# EasyEDA Pro project busmaster-v102.eprj, schematic main-board
Board Name: main-board; Create Date: 2025-11-11; Page Name: P1; Project Name: busmaster-v102; Schematic Name: main-board; Update Date: 2026-09-04; Company: EasyEDA.com; Page Size: A4; Version: V1.0
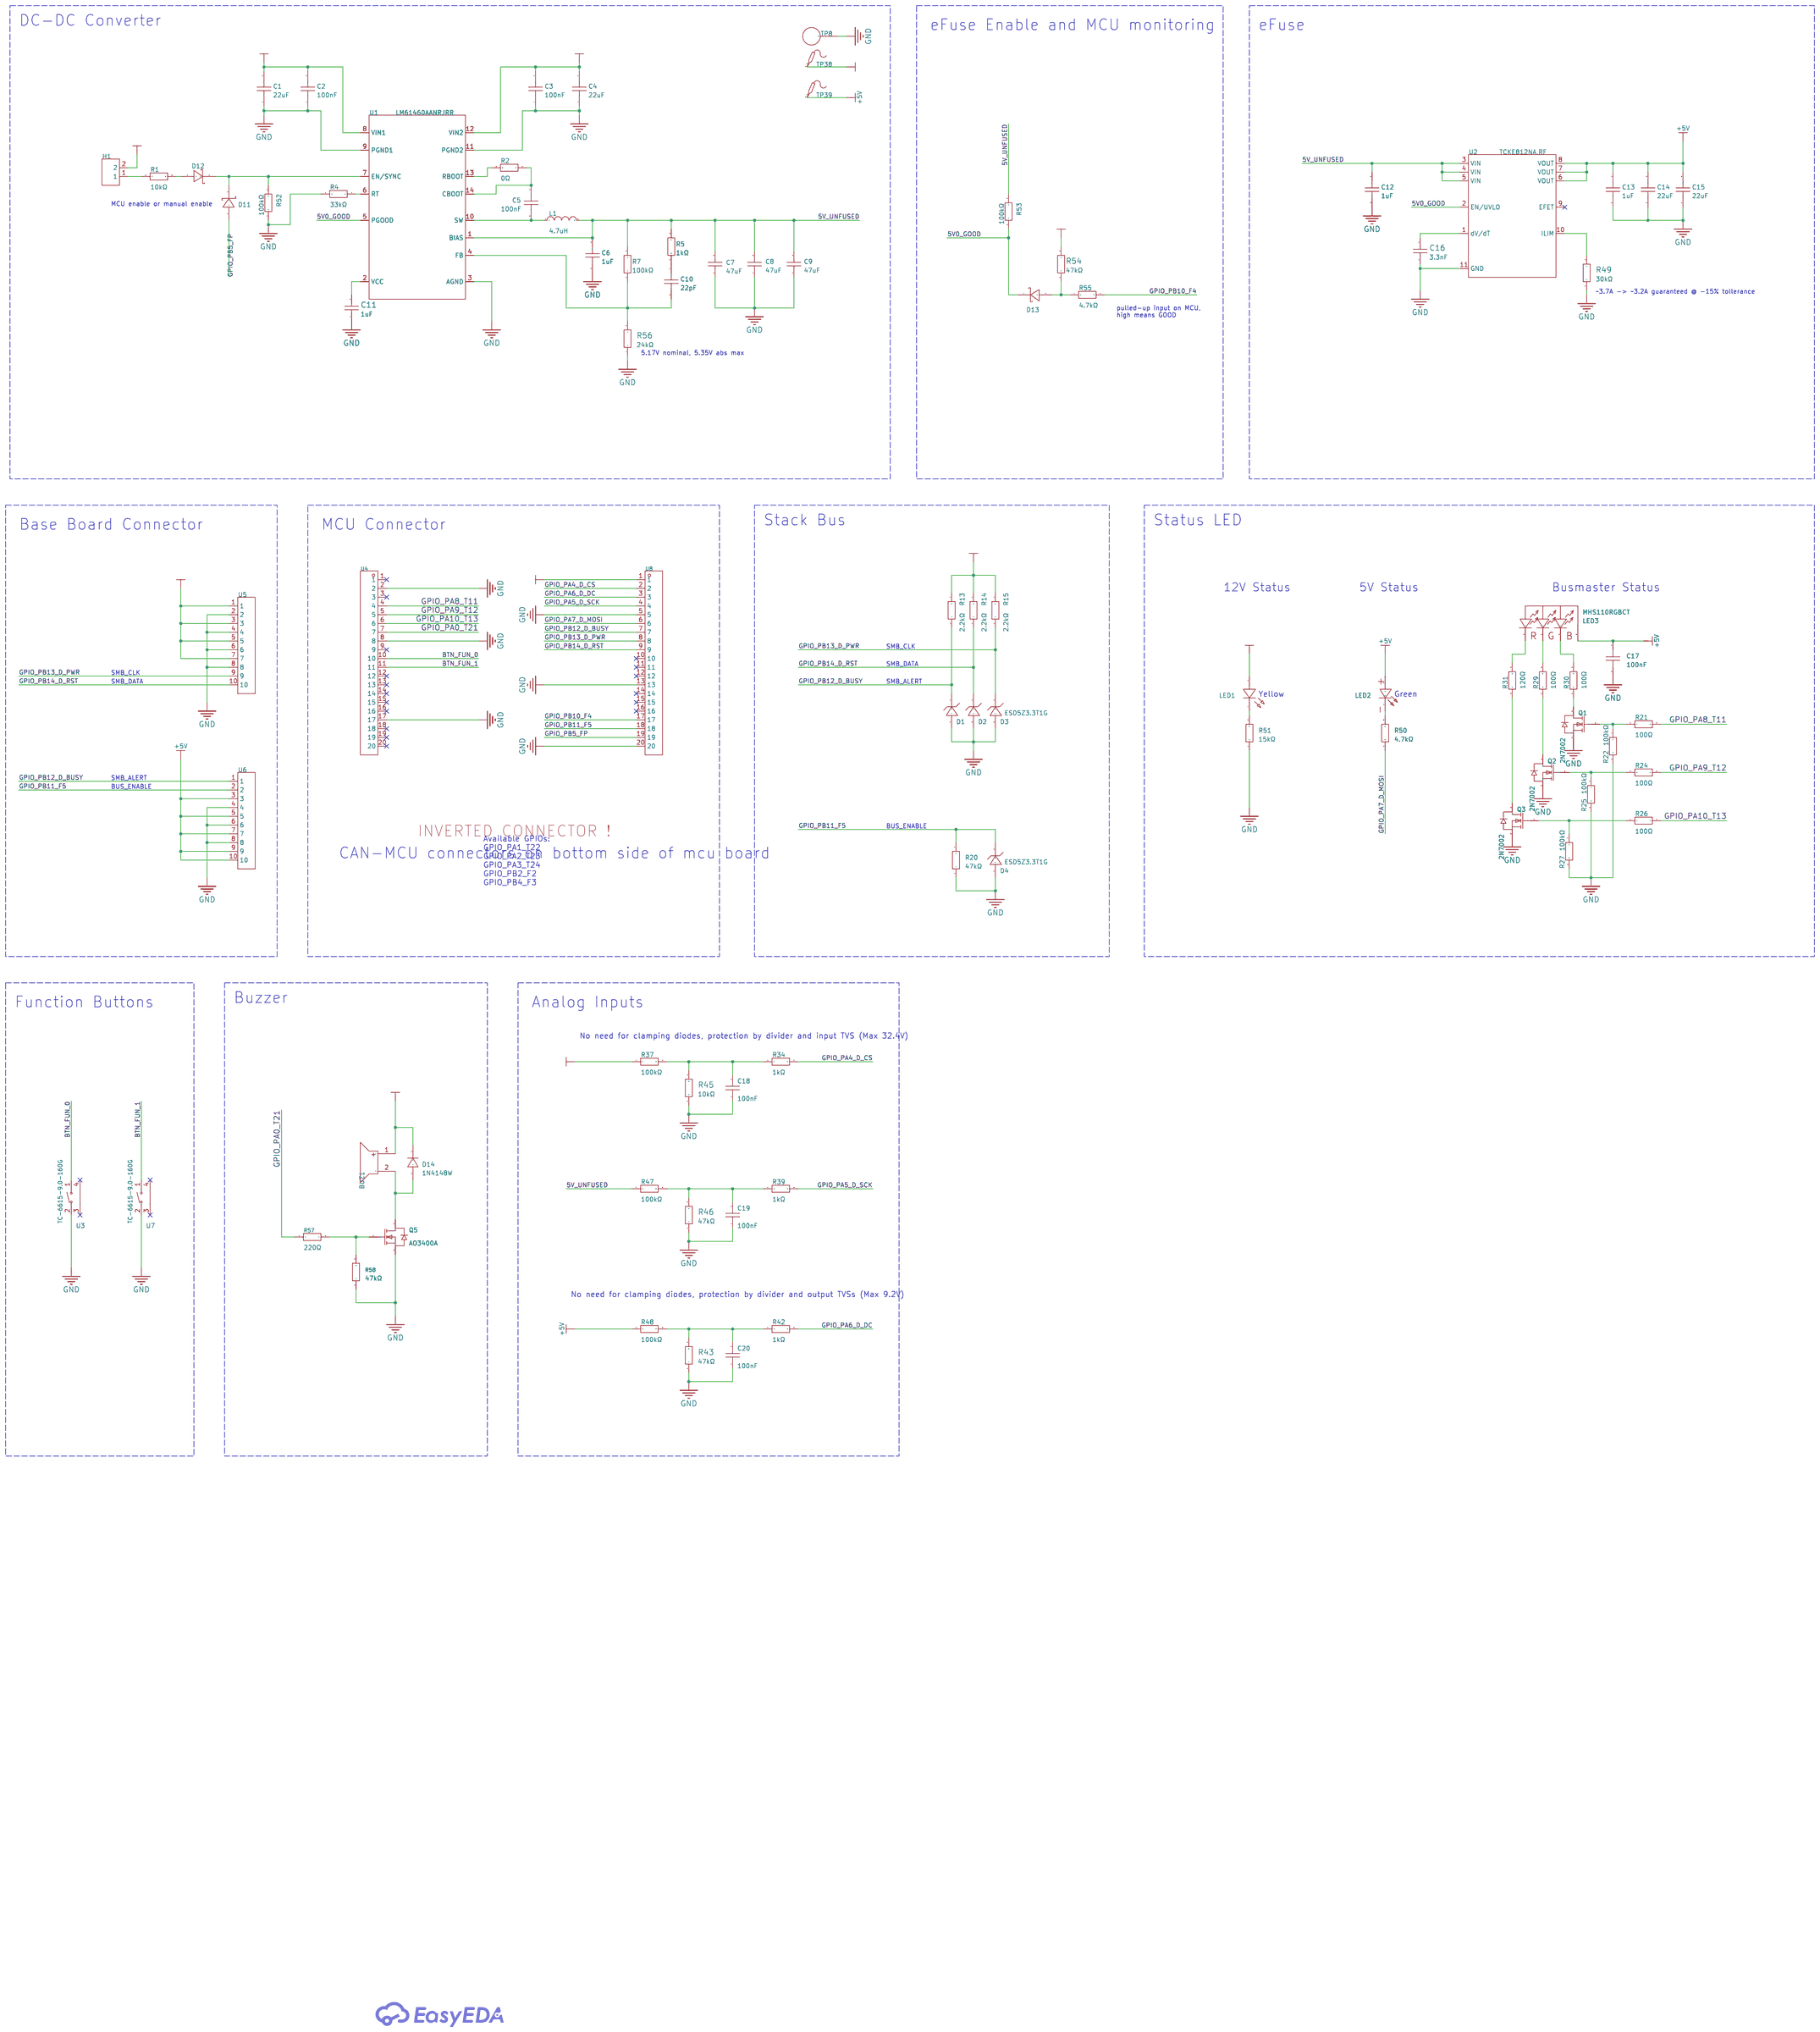
[diagram p2: schematic sheet]

## Parts
BUZ1  2.7kHz  [BUZ-TH_BD9.0-P4.00-D0.6-FD]
C1  22uF  [C2220]
C2  100nF  [C0603]
C3  100nF  [C0603]
C4  22uF  [C2220]
C5  100nF  [C0603]
C6  1uF  [C0805]
C7  47uF  [C1210]
C8  47uF  [C1210]
C9  47uF  [C1210]
C10  22pF  [C0603]
C11  1uF  [C0805]
C12  1uF  [C0805]
C13  1uF  [C0805]
C14  22uF  [C1206]
C15  22uF  [C1206]
C16  3.3nF  [C0603]
C17  100nF  [C0603]
C18  100nF  [C0603]
C19  100nF  [C0603]
C20  100nF  [C0603]
D1  ESD5Z3.3T1G  [SOD-523_L1.2-W0.8-LS1.6-FD]
D2  ESD5Z3.3T1G  [SOD-523_L1.2-W0.8-LS1.6-FD]
D3  ESD5Z3.3T1G  [SOD-523_L1.2-W0.8-LS1.6-FD]
D4  ESD5Z3.3T1G  [SOD-523_L1.2-W0.8-LS1.6-FD]
D11  1N5819WS  [SOD-323_L1.8-W1.3-LS2.5-RD]
D12  1N5819WS  [SOD-323_L1.8-W1.3-LS2.5-RD]
D13  1N5819WS  [SOD-323_L1.8-W1.3-LS2.5-RD]
D14  1N4148W  [SOD-123F_L2.7-W1.6-LS3.8-RD]
H1  PZ254V-11-02P  [HDR-TH_2P-P2.54-V-M]
L1  4.7uH  [IND-SMD_L10.9-W10.0]
LED1  XL-1606UYC  [LED-SMD_L1.7-W1.1-RD_27-21]
LED2  LTST-S220TGKT  [LED-SMD_L2.2-W0.6-RD_GREEN]
LED3  MHS110RGBCT  [LED-ARRAY-SMD_MHS110RGBCT]
Q1  2N7002  [SOT-23-3_L2.9-W1.3-P1.90-LS2.4-BR]
Q2  2N7002  [SOT-23-3_L2.9-W1.3-P1.90-LS2.4-BR]
Q3  2N7002  [SOT-23-3_L2.9-W1.3-P1.90-LS2.4-BR]
Q5  AO3400A  [SOT-23-3_L2.9-W1.3-P1.90-LS2.4-BR]
R1  10kΩ  [R0603]
R2  0Ω  [R0603]
R4  33kΩ  [R0603]
R5  1kΩ  [R0603]
R7  100kΩ  [R0603]
R13  2.2kΩ  [R0603]
R14  2.2kΩ  [R0603]
R15  2.2kΩ  [R0603]
R20  47kΩ  [R0603]
R21  100Ω  [R0603]
R22  100kΩ  [R0603]
R24  100Ω  [R0603]
R25  100kΩ  [R0603]
R26  100Ω  [R0603]
R27  100kΩ  [R0603]
R29  100Ω  [R0603]
R30  100Ω  [R0603]
R31  120Ω  [R0603]
R34  1kΩ  [R0603]
R37  100kΩ  [R0603]
R39  1kΩ  [R0603]
R42  1kΩ  [R0603]
R43  47kΩ  [R0603]
R45  10kΩ  [R0603]
R46  47kΩ  [R0603]
R47  100kΩ  [R0603]
R48  100kΩ  [R0603]
R49  30kΩ  [R0603]
R50  4.7kΩ  [R0603]
R51  15kΩ  [R0603]
R52  100kΩ  [R0603]
R53  100kΩ  [R0603]
R54  47kΩ  [R0603]
R55  4.7kΩ  [R0603]
R56  24kΩ  [R0603]
R57  220Ω  [R0603]
R58  47kΩ  [R0603]
TP8  RH-5004  [TESTPOINT_TH_BD2.5-D1.2]
TP38  -  [Test-Point-0.5mm]
TP39  -  [Test-Point-0.5mm]
U1  LM61460AANRJRR  [VQFN-HR-14_L4.0-W3.5-P0.50-TL_TI_RJR-1]
U2  TCKE812NA,RF  [VSON-10_L3.0-W3.0-P0.50-TL-EP]
U3  TC-6615-9.0-160G  [KEY-TH_PTS645VXX83XLFS]
U4  KH-2.54FH-1X20P-H8.5  [HDR-TH_20P-P2.54-V-F-2]
U5  2541WR-10P  [HDR-TH_10P-P2.54-H-M-W10.4]
U6  2541WR-10P  [HDR-TH_10P-P2.54-H-M-W10.4]
U7  TC-6615-9.0-160G  [KEY-TH_PTS645VXX83XLFS]
U8  KH-2.54FH-1X20P-H8.5  [HDR-TH_20P-P2.54-V-F-2]

## Library data of the parts
BUZ1 = QMB-09B-03: Driver Circuitry:Passive (Externally Driven) Technology:Electromagnetic Voltage Rating:3V Voltage - Supply:2V~5V Voltage - Supply:2V~5V Frequency:2.7kHz Current Consumption:50mA Sound Pressure Level(SPL):85dB Diameter(φD):9mm Length:- Width:- Height:5.7mm; LCSC Part Name: 无源蜂鸣器QMB-09B-03; Supplier Part: C96256; Manufacturer: 华能; Supplier Footprint: 插件,D=9mm; Datasheet: https://item.szlcsc.com/datasheet/QMB-09B-03/97460.html; Supplier: LCSC; Driver Circuitry: Passive (Externally Driven); Technology: Electromagnetic; Voltage Rating: 3V; Voltage - Supply: 2V~5V; Current Consumption: 50mA; Sound Pressure Level(SPL): 85dB; Diameter(φD): 9mm; Height: 5.7mm; Operating Temperature: -20℃~+70℃
C1 C4 = FS55X226K500EHG: LCSC Part Name: 22uF ±10% 50V; Supplier Part: C784103; Manufacturer: PSA(信昌电陶); Supplier Footprint: 2220; JLCPCB Part Class: Extended Part; Datasheet: https://atta.szlcsc.com/upload/public/pdf/source/20190723/C381466_B1CCDB289216E7EE775C98769E222CFD.pdf; Supplier: LCSC; Tolerance: ±10%; Voltage Rating: 50V; Temperature Coefficient: X7R
C2 C3 C5 C17-C20 = CC0603KRX7R9BB104: Capacitance:100nF Tolerance:±10% Tolerance:±10% Voltage Rating:50V Temperature Coefficient:X7R; LCSC Part Name: 100nF ±10% 50V; Supplier Part: C14663; Manufacturer: YAGEO(国巨); Supplier Footprint: 0603; JLCPCB Part Class: Basic Part; Datasheet: https://item.szlcsc.com/datasheet/CC0603KRX7R9BB104/15331.html; Supplier: LCSC; Tolerance: ±10%; Voltage Rating: 50V; Temperature Coefficient: X7R
C6 C12 C13 = CL21B105KBFNNNE: Capacitance:1uF Tolerance:±10% Tolerance:±10% Voltage Rating:50V Temperature Coefficient:X7R; LCSC Part Name: 1uF ±10% 50V; Supplier Part: C28323; Manufacturer: SAMSUNG(三星); Supplier Footprint: 0805; JLCPCB Part Class: Basic Part; Datasheet: https://item.szlcsc.com/datasheet/CL21B105KBFNNNE/29074.html; Supplier: LCSC; Tolerance: ±10%; Voltage Rating: 50V; Temperature Coefficient: X7R
C7-C9 = GRM32ER71A476KE15L: LCSC Part Name: 47uF ±10% 10V; Supplier Part: C84494; Manufacturer: muRata(村田); Supplier Footprint: 1210; JLCPCB Part Class: Extended Part; Datasheet: https://atta.szlcsc.com/upload/public/pdf/source/20161226/1482720144456.pdf; Supplier: LCSC; Tolerance: ±10%
C10 = CL10C220JB8NNNC: Capacitance:22pF Tolerance:±5% Tolerance:±5% Voltage Rating:50V Temperature Coefficient:C0G; LCSC Part Name: 22pF ±5% 50V; Supplier Part: C1653; Manufacturer: SAMSUNG(三星); Supplier Footprint: 0603; JLCPCB Part Class: Basic Part; Datasheet: https://item.szlcsc.com/datasheet/CL10C220JB8NNNC/2005.html; Supplier: LCSC; Tolerance: ±5%; Voltage Rating: 50V; Temperature Coefficient: C0G
C11 = CL21B105KBFNNNE: LCSC Part Name: 1uF ±10% 50V; Supplier Part: C28323; Manufacturer: SAMSUNG(三星); Supplier Footprint: 0805; JLCPCB Part Class: Basic Part; Datasheet: https://item.szlcsc.com/datasheet/CL21B105KBFNNNE/29074.html; Supplier: LCSC; Tolerance: ±10%; Voltage Rating: 50V; Temperature Coefficient: X7R
C14 C15 = CL31B226KPHNNNE: LCSC Part Name: 22uF ±10% 10V; Supplier Part: C87996; Manufacturer: SAMSUNG(三星); Supplier Footprint: 1206; JLCPCB Part Class: Extended Part; Datasheet: https://item.szlcsc.com/datasheet/CL31B226KPHNNNE/89174.html; Supplier: LCSC; Tolerance: ±10%; Voltage Rating: 10V; Temperature Coefficient: X7R
C16 = CL10B332KB8NNNC: LCSC Part Name: 3.3nF ±10% 50V; Supplier Part: C1613; Manufacturer: SAMSUNG(三星); Supplier Footprint: 0603; JLCPCB Part Class: Basic Part; Datasheet: https://item.szlcsc.com/datasheet/CL10B332KB8NNNC/1965.html; Supplier: LCSC; Tolerance: ±10%; Voltage Rating: 50V; Temperature Coefficient: X7R
D1-D4 = ESD5Z3.3T1G: LCSC Part Name: 单向ESD 3.3V截止 峰值浪涌电流：11A; Supplier Part: C2827729; Manufacturer: TECH PUBLIC(台舟); Supplier Footprint: SOD-523; JLCPCB Part Class: Extended Part; Datasheet: https://item.szlcsc.com/datasheet/ESD5Z3.3T1G/2973411.html; Supplier: LCSC; Polarity: Unidirectional; Reverse Stand-Off Voltage (Vrwm): 3.3V; Clamping Voltage: 14V; Peak Pulse Current (Ipp): 11A; Peak Pulse Power Dissipation (Ppp): 150W; Voltage - Breakdown: 5V; Reverse Leakage Current (Ir): 200nA; Number of Channels: 1.0; Operating Temperature: -55℃~+125℃; level of protection: IEC 61000-4-2；IEC 61000-4-4; Type: ESD; Junction Capacitance: 110pF
D11-D13 = 1N5819WS_C191023: LCSC Part Name: 电压:40V 电流:1A; Supplier Part: C191023; Manufacturer: Hottech(合科泰); Supplier Footprint: SOD-323; Datasheet: https://item.szlcsc.com/datasheet/1N5819WS/213850.html; Supplier: LCSC; Voltage - Forward(Vf@If): 600mV@1A; Voltage - DC Reverse(Vr): 40V; Current - Rectified: 1A; Non-Repetitive Peak Forward Surge Current: 25A
D14 = 1N4148W_C81598: LCSC Part Name: 75V 150mA; Supplier Part: C81598; Manufacturer: ST(先科); Supplier Footprint: SOD-123; Datasheet: https://item.szlcsc.com/datasheet/1N4148W/82750.html; Supplier: LCSC; Diode Configuration: Standalone; Pd - Power Dissipation: 400mW; Current - Rectified: 150mA; Voltage - DC Reverse(Vr): 75V; Voltage - Forward(Vf@If): 1V@50mA; Non-Repetitive Peak Forward Surge Current: 1A; Reverse Leakage Current (Ir): 1uA@75V; Reverse Recovery Time (trr): 4ns
H1 = PZ254V-11-02P: LCSC Part Name: 1x2P 间距:2.54mm 方针 直插; Supplier Part: C492401; Manufacturer: XFCN(兴飞); Supplier Footprint: 插件,P=2.54mm; JLCPCB Part Class: Extended Part; Datasheet: https://item.szlcsc.com/datasheet/PZ254V-11-02P/502957.html; Supplier: LCSC; Pin Structure: 1x2P; Pitch: 2.54mm; Circluar Pins/Square Pins: Pin Header; Mounting Type: Through Hole; Number of Rows: 1; Number of Pins: 2P; Length of Mating Pin: 6mm; Insulation Height: 2.5mm; Length of End Connection Pin: 3mm; Contact Material: Brass; Operating Temperature: -40℃~+105℃; Color: Black
L1 = ETQP6M4R7YLC: LCSC Part Name: 4.7uH ±20%; Supplier Part: C409643; Manufacturer: PANASONIC(松下); Supplier Footprint: SMD,10.9x10mm; JLCPCB Part Class: Extended Part; Datasheet: https://atta.szlcsc.com/upload/public/pdf/source/20190806/C409643_EEE3F0D2849D06837D605D0504463401.pdf; Supplier: LCSC; Tolerance: ±20%; Current Rating: 11.8A; DC Resistance(DCR): 8.7mΩ; Type: Molded Inductor; Ratings: AEC-Q200
LED1 = XL-1606UYC: LCSC Part Name: 0602黄色贴片式发光二极管; Supplier Part: C965862; Manufacturer: XINGLIGHT(成兴光); Supplier Footprint: SMD,1.7x1.1mm; JLCPCB Part Class: Extended Part; Datasheet: https://item.szlcsc.com/datasheet/XL-1606UYC/1051471.html; Supplier: LCSC; Illumination Color: Yellow; Voltage - Forward(Vf): 2.4V; Power(Watts): 50mW; Forward Current: 20mA; Wavelength - Dominant: 585nm~595nm; Peak Wavelength: 588nm; Lens Color: Water Clear; Luminous Intensity: 800mcd; Viewing Angle: 120°; Mounting Style: Side View Mount
LED2 = LTST-S220TGKT: LCSC Part Name: 普绿/黄绿 侧贴; Supplier Part: C160470; Manufacturer: LITEON(光宝); Supplier Footprint: SMD,1x2.2mm; JLCPCB Part Class: Extended Part; Datasheet: https://item.szlcsc.com/datasheet/LTST-S220TGKT/171850.html; Supplier: LCSC; Illumination Color: Yellow Green; Voltage - Forward(Vf): 3.2V; Power(Watts): 76mW; Forward Current: 20mA; Wavelength - Dominant: 525nm; Peak Wavelength: 530nm; Lens Color: Water Clear; Luminous Intensity: 260.5mcd; Viewing Angle: 130°; Mounting Style: Side View Mount; Operating Temperature: -20℃~+80℃
LED3 = MHS110RGBCT: LCSC Part Name: RGB三色 侧贴; Supplier Part: C389528; Manufacturer: MEIHUA(美华); Supplier Footprint: SMD,1.5x3mm; JLCPCB Part Class: Extended Part; Datasheet: https://atta.szlcsc.com/upload/public/pdf/source/20190530/C389528_18CC971B89683121AF99AD38EE2CA1FC.pdf; Supplier: LCSC
Q1-Q3 = 2N7002_C8545: LCSC Part Name: 1个N沟道 耐压:60V 电流:115mA; Supplier Part: C8545; Manufacturer: CJ(江苏长电/长晶); Supplier Footprint: SOT-23; JLCPCB Part Class: Basic Part; Datasheet: https://item.szlcsc.com/datasheet/2N7002/9040.html; Supplier: LCSC; Number: 1 N-Channel; Drain to Source Voltage: 60V; Current - Continuous Drain(Id): 115mA; RDS(on): 5Ω@10V; Pd - Power Dissipation: 225mW; Gate Threshold Voltage (Vgs(th)): 2.5V; Input Capacitance(Ciss): 50pF; Reverse Transfer Capacitance (Crss@Vds): 5pF
Q5 = AO3400A_C20917: LCSC Part Name: 1个N沟道 耐压:30V 电流:5.7A; Supplier Part: C20917; Manufacturer: AOS; Supplier Footprint: SOT-23-3L; JLCPCB Part Class: Basic Part; Datasheet: https://item.szlcsc.com/datasheet/AO3400A/21629.html; Supplier: LCSC; Drain to Source Voltage: 30V; RDS(on): 48mΩ@2.5V; Gate Threshold Voltage (Vgs(th)): 1.45V@250uA; Gate Charge(Qg): 7nC@10V; Input Capacitance(Ciss): 630pF@15V; Operating Temperature: -55℃~+150℃@(Tj); Type: N-Channel
R1 = 0603WAF1002T5E: Type:Thick Film Resistor Resistance:10kΩ Tolerance:±1% Tolerance:±1% Power(Watts):100mW Voltage-Supply(Max):75V Temperature Coefficient:±100ppm/℃ Temperature Coefficient:±100ppm/℃ Operating Temperature:-55℃~+155℃ Operating Temperature:-55℃~+155℃; LCSC Part Name: 厚膜电阻 10kΩ ±1% 100mW; Supplier Part: C25804; Manufacturer: UNI-ROYAL(厚声); Supplier Footprint: 0603; JLCPCB Part Class: Basic Part; Datasheet: https://item.szlcsc.com/datasheet/0603WAF1002T5E/26547.html; Supplier: LCSC; Type: Thick Film Resistor; Tolerance: ±1%; Power(Watts): 100mW; Voltage-Supply(Max): 75V; Temperature Coefficient: ±100ppm/℃; Operating Temperature: -55℃~+155℃
R2 = 0603WAF0000T5E: Type:Thick Film Resistor Resistance:0Ω Tolerance:±1% Tolerance:±1% Power(Watts):100mW Voltage-Supply(Max):75V Temperature Coefficient:- Temperature Coefficient:- Operating Temperature:-55℃~+155℃ Operating Temperature:-55℃~+155℃; LCSC Part Name: 0Ω ±1% 100mW 厚膜电阻; Supplier Part: C21189; Manufacturer: UNI-ROYAL(厚声); Supplier Footprint: 0603; JLCPCB Part Class: Basic Part; Datasheet: https://item.szlcsc.com/datasheet/0603WAF0000T5E/21903.html; Supplier: LCSC; Type: Thick Film Resistor; Tolerance: ±1%; Power(Watts): 100mW; Voltage-Supply(Max): 75V; Operating Temperature: -55℃~+155℃
R4 = 0603WAF3302T5E: Type:Thick Film Resistor Resistance:33kΩ Tolerance:±1% Tolerance:±1% Power(Watts):100mW Voltage-Supply(Max):75V Temperature Coefficient:±100ppm/℃ Temperature Coefficient:±100ppm/℃ Operating Temperature:-55℃~+155℃ Operating Temperature:-55℃~+155℃; LCSC Part Name: 33kΩ ±1% 100mW 厚膜电阻; Supplier Part: C4216; Manufacturer: UNI-ROYAL(厚声); Supplier Footprint: 0603; JLCPCB Part Class: Basic Part; Datasheet: https://item.szlcsc.com/datasheet/0603WAF3302T5E/4623.html; Supplier: LCSC; Type: Thick Film Resistor; Tolerance: ±1%; Power(Watts): 100mW; Voltage-Supply(Max): 75V; Temperature Coefficient: ±100ppm/℃; Operating Temperature: -55℃~+155℃
R5 R34 R39 R42 = 0603WAF1001T5E: Type:Thick Film Resistors Resistance:1kΩ Tolerance:±1% Tolerance:±1% Power(Watts): Overload Voltage (Max): Temperature Coefficient:±100ppm/℃ Temperature Coefficient:±100ppm/℃ Operating Temperature Range:-55℃~+155℃ Operating Temperature Range:-55℃~+155℃; LCSC Part Name: 1kΩ ±1% 100mW 厚膜电阻; Supplier Part: C21190; Manufacturer: UNI-ROYAL(厚声); Supplier Footprint: 0603; JLCPCB Part Class: Basic Part; Datasheet: https://atta.szlcsc.com/upload/public/pdf/source/20200306/C422600_1E6D84923E4A46A82E41ADD87F860B5C.pdf; Supplier: LCSC; Type: Thick Film Resistors; Tolerance: ±1%; Temperature Coefficient: ±100ppm/℃; Operating Temperature Range: -55℃~+155℃
R7 R22 R25 R27 R37 R47 R48 R52 R53 = 0603WAF1003T5E: Type:Thick Film Resistor Resistance:100kΩ Tolerance:±1% Tolerance:±1% Power(Watts):100mW Voltage-Supply(Max):75V Temperature Coefficient:±100ppm/℃ Temperature Coefficient:±100ppm/℃ Operating Temperature:-55℃~+155℃ Operating Temperature:-55℃~+155℃; LCSC Part Name: 100kΩ ±1% 100mW 厚膜电阻; Supplier Part: C25803; Manufacturer: UNI-ROYAL(厚声); Supplier Footprint: 0603; JLCPCB Part Class: Basic Part; Datasheet: https://item.szlcsc.com/datasheet/0603WAF1003T5E/26546.html; Supplier: LCSC; Type: Thick Film Resistor; Tolerance: ±1%; Power(Watts): 100mW; Voltage-Supply(Max): 75V; Temperature Coefficient: ±100ppm/℃; Operating Temperature: -55℃~+155℃
R13-R15 = 0603WAF2201T5E_C4190: Type:Thick Film Resistors Resistance:2.2kΩ Tolerance:±1% Tolerance:±1% Power(Watts): Overload Voltage (Max): Temperature Coefficient:±100ppm/℃ Temperature Coefficient:±100ppm/℃ Operating Temperature Range:-55℃~+155℃ Operating Temperature Range:-55℃~+155℃; LCSC Part Name: 2.2kΩ ±1% 100mW 厚膜电阻; Supplier Part: C4190; Manufacturer: UNI-ROYAL(厚声); Manufacturer Part: 0603WAF2201T5E; Supplier Footprint: 0603; JLCPCB Part Class: Basic Part; Datasheet: https://atta.szlcsc.com/upload/public/pdf/source/20200306/C422600_1E6D84923E4A46A82E41ADD87F860B5C.pdf; Supplier: LCSC; Type: Thick Film Resistors; Tolerance: ±1%; Temperature Coefficient: ±100ppm/℃; Operating Temperature Range: -55℃~+155℃
R20 R43 R46 R54 R58 = 0603WAF4702T5E: Type:Thick Film Resistor Resistance:47kΩ Tolerance:±1% Tolerance:±1% Power(Watts):100mW Voltage-Supply(Max):75V Temperature Coefficient:±100ppm/℃ Temperature Coefficient:±100ppm/℃ Operating Temperature:-55℃~+155℃ Operating Temperature:-55℃~+155℃; LCSC Part Name: 47kΩ ±1% 100mW 厚膜电阻; Supplier Part: C25819; Manufacturer: UNI-ROYAL(厚声); Supplier Footprint: 0603; JLCPCB Part Class: Basic Part; Datasheet: https://item.szlcsc.com/datasheet/0603WAF4702T5E/26562.html; Supplier: LCSC; Type: Thick Film Resistor; Tolerance: ±1%; Power(Watts): 100mW; Voltage-Supply(Max): 75V; Temperature Coefficient: ±100ppm/℃; Operating Temperature: -55℃~+155℃
R21 R24 R26 R29 R30 = 0603WAF1000T5E: Type:Thick Film Resistors Resistance: Tolerance:±1% Tolerance:±1% Power(Watts): Overload Voltage (Max): Temperature Coefficient:±200ppm/℃ Temperature Coefficient:±200ppm/℃ Operating Temperature Range:-55℃~+155℃ Operating Temperature Range:-55℃~+155℃; LCSC Part Name: 100Ω ±1% 100mW 厚膜电阻; Supplier Part: C22775; Manufacturer: UNI-ROYAL(厚声); Supplier Footprint: 0603; JLCPCB Part Class: Basic Part; Datasheet: https://atta.szlcsc.com/upload/public/pdf/source/20200306/C422600_1E6D84923E4A46A82E41ADD87F860B5C.pdf; Supplier: LCSC; Type: Thick Film Resistors; Tolerance: ±1%; Temperature Coefficient: ±200ppm/℃; Operating Temperature Range: -55℃~+155℃
R31 = 0603WAF1200T5E: Type:Thick Film Resistors Resistance: Tolerance:±1% Tolerance:±1% Power(Watts): Overload Voltage (Max): Temperature Coefficient:±100ppm/℃ Temperature Coefficient:±100ppm/℃ Operating Temperature Range:-55℃~+155℃ Operating Temperature Range:-55℃~+155℃; LCSC Part Name: 120Ω ±1% 100mW 厚膜电阻; Supplier Part: C22787; Manufacturer: UNI-ROYAL(厚声); Supplier Footprint: 0603; JLCPCB Part Class: Basic Part; Datasheet: https://atta.szlcsc.com/upload/public/pdf/source/20200306/C422600_1E6D84923E4A46A82E41ADD87F860B5C.pdf; Supplier: LCSC; Type: Thick Film Resistors; Tolerance: ±1%; Temperature Coefficient: ±100ppm/℃; Operating Temperature Range: -55℃~+155℃
R45 = 0603WAF1002T5E: LCSC Part Name: 厚膜电阻 10kΩ ±1% 100mW; Supplier Part: C25804; Manufacturer: UNI-ROYAL(厚声); Supplier Footprint: 0603; JLCPCB Part Class: Basic Part; Datasheet: https://item.szlcsc.com/datasheet/0603WAF1002T5E/26547.html; Supplier: LCSC; Type: Thick Film Resistor; Tolerance: ±1%; Power(Watts): 100mW; Voltage-Supply(Max): 75V; Temperature Coefficient: ±100ppm/℃; Operating Temperature: -55℃~+155℃
R49 = 0603WAF3002T5E: LCSC Part Name: 30kΩ ±1% 100mW 厚膜电阻; Supplier Part: C22984; Manufacturer: UNI-ROYAL(厚声); Supplier Footprint: 0603; Datasheet: https://item.szlcsc.com/datasheet/0603WAF3002T5E/23711.html; Supplier: LCSC; Type: Thick Film Resistor; Tolerance: ±1%; Power(Watts): 100mW; Voltage-Supply(Max): 75V; Temperature Coefficient: ±100ppm/℃; Operating Temperature: -55℃~+155℃
R50 R55 = 0603WAF4701T5E: LCSC Part Name: 厚膜电阻 4.7kΩ ±1%; Supplier Part: C23162; Manufacturer: UNI-ROYAL(厚声); Supplier Footprint: 0603; Datasheet: https://item.szlcsc.com/datasheet/0603WAF4701T5E/23889.html; Supplier: LCSC; Type: Thick Film Resistor; Tolerance: ±1%; Power(Watts): 100mW; Voltage-Supply(Max): 75V; Temperature Coefficient: ±100ppm/℃; Operating Temperature: -55℃~+155℃
R51 = 0603WAF1502T5E: LCSC Part Name: 15kΩ ±1% 100mW 厚膜电阻; Supplier Part: C22809; Manufacturer: UNI-ROYAL(厚声); Supplier Footprint: 0603; JLCPCB Part Class: Basic Part; Datasheet: https://item.szlcsc.com/datasheet/0603WAF1502T5E/23536.html; Supplier: LCSC; Type: Thick Film Resistor; Tolerance: ±1%; Power(Watts): 100mW; Voltage-Supply(Max): 75V; Temperature Coefficient: ±100ppm/℃; Operating Temperature: -55℃~+155℃
R56 = 0603WAF2402T5E: LCSC Part Name: 厚膜电阻 24kΩ ±1%; Supplier Part: C23352; Manufacturer: UNI-ROYAL(厚声); Supplier Footprint: 0603; Datasheet: https://item.szlcsc.com/datasheet/0603WAF2402T5E/24085.html; Supplier: LCSC; Type: Thick Film Resistor; Tolerance: ±1%; Power(Watts): 100mW; Voltage-Supply(Max): 75V; Temperature Coefficient: ±100ppm/℃; Operating Temperature: -55℃~+155℃
R57 = 0603WAF2200T5E: LCSC Part Name: 220Ω ±1% 100mW 厚膜电阻; Supplier Part: C22962; Manufacturer: UNI-ROYAL(厚声); Supplier Footprint: 0603; Datasheet: https://atta.szlcsc.com/upload/public/pdf/source/20200306/C422600_1E6D84923E4A46A82E41ADD87F860B5C.pdf; Supplier: LCSC; Type: Thick Film Resistors; Tolerance: ±1%; Temperature Coefficient: ±100ppm/℃; Operating Temperature Range: -55℃~+155℃
TP8 = RH-5004: Connector Type:Pin type (through board) Plastic Color:Yellow Board Space (Diameter φ/ Length x Width):2.5mm; LCSC Part Name: PCB电路板测试点/测试针; Supplier Part: C5199804; Manufacturer: 荣和; JLCPCB Part Class: Extended Part; Supplier: LCSC; Connector Type: Pin type (through board); Plastic Color: Yellow; Board Space (Diameter φ/ Length x Width): 2.5mm
TP38 TP39 = Test-Point
U1 = LM61460AANRJRR: LCSC Part Name: 3V至36V、6A低EMI同步降压转换器; Supplier Part: C2864505; Manufacturer: TI(德州仪器); Supplier Footprint: VQFN-14-HR(3.5x4); JLCPCB Part Class: Extended Part; Datasheet: https://www.ti.com/cn/lit/gpn/lm61460; Supplier: LCSC; Function: Step-down type; Output Type: Adjustable; Input Voltage: 3V~36V; Output Current: 6A; Switching Frequency: 200kHz~2.2MHz; Operating Temperature: -40℃~+150℃; Synchronous Rectification: Yes; Number of Outputs: 1; Topology: Step-down; Switch tube (built-in/external): Built-in
U2 = TCKE812NA,RF: Voltage Rating:18V Voltage Rating:18V; Supplier Part: C1880271; Manufacturer: TOSHIBA(东芝); Supplier Footprint: VSON-10-EP(3x3); JLCPCB Part Class: Extended Part; Datasheet: https://item.szlcsc.com/datasheet/TCKE812NA%252CRF/1971090.html; Supplier: LCSC; Voltage Rating: 18V
U3 U7 = TC-6615-9.0-160G: LCSC Part Name: 6*6*9mm 卧插 轻触开关; Supplier Part: C6575016; Manufacturer: HCTL(华灿天禄); Supplier Footprint: 插件; JLCPCB Part Class: Extended Part; Datasheet: https://atta.szlcsc.com/upload/public/pdf/source/20230523/20C79B748B4ACB531A66068A8A6BD305.pdf; Supplier: LCSC; Circuit: SPST; Actuator Style: Round Button; Operating Force: 160gf; Mounting Style: Horizontal Plug; Switch Length: 6mm; Switch Width: 6mm; Switch Height: 9mm; Strike Gundam: With bracket; Contact Current: 50mA; Voltage Rating (DC): 12V; Insulation Resistance: 100MΩ; Actuator/Cap Color: Black; With Lamp: None; Mechanical Life: 100000 Times; Operating Temperature: -25℃~+85℃
U4 U8 = KH-2.54FH-1X20P-H8.5: Holes Structure:1x20P Pitch:2.54mm Row Spacing:- Circular Hole / Square Hole:Square Hole Mounting Type:Through Hole Number of Rows:1 Number of Positions:20P Current Rating:3A Voltage Rating (Max):- Holes Direction:Top Insulation Height:8.5mm Operating Tem; LCSC Part Name: 间距:2.54mm 1x20P 直插; Supplier Part: C2905423; Manufacturer: kinghelm(金航标); Supplier Footprint: 插件,P=2.54mm; Datasheet: https://item.szlcsc.com/datasheet/KH-2.54FH-1X20P-H8.5/3175197.html; Supplier: LCSC; Holes Structure: 1x20P; Pitch: 2.54mm; Circular Hole / Square Hole: Square Hole; Mounting Type: Through Hole; Number of Rows: 1; Number of Positions: 20P; Current Rating: 3A; Holes Direction: Top; Insulation Height: 8.5mm; Operating Temperature: -40℃~+105℃
U5 U6 = 2541WR-10P: LCSC Part Name: 1x10P 间距:2.54mm 方针 弯插; Supplier Part: C5383101; Manufacturer: HanElectricity(瀚源); Supplier Footprint: 弯插,P=2.54mm; JLCPCB Part Class: Extended Part; Datasheet: https://item.szlcsc.com/datasheet/2541WR-10P/6258461.html; Supplier: LCSC; Pin Structure: 1x10P; Pitch: 2.54mm; Circluar Pins/Square Pins: Pin Header; Mounting Type: Right Angle; Number of Rows: 1; Number of Pins: 10P; Current Rating: 3A; Length of Mating Pin: 6mm; Insulation Height: 2.54mm; Contact Material: Brass; Contact Plating: Gold; Operating Temperature: -40℃~+105℃; Color: Black

## Nets
5V0_GOOD: D13.1(K) R53.1 U1.5(PGOOD) U2.2(EN/UVLO)
5V_UNFUSED: C6.1 C7.2 C8.2 C9.2 C12.1 L1.2 R5.2 R7.2 R47.1 R53.2 U1.1(BIAS) U2.3(VIN) U2.4(VIN) U2.5(VIN)
+3V3: BUZ1.1 D14.1(K) R13.2 R14.2 R15.2 R54.2 U8.1
+5V: C13.1 C14.2 C15.2 C17.1 LED2.2(A) LED3.2(+) R48.1 TP39.1 U2.6(VOUT) U2.7(VOUT) U2.8(VOUT) U6.3 U6.5 U6.7 U6.9 U6.10
+12V: C1.2 C2.2 C3.2 C4.2 H1.2 LED1.2(A) R37.1 TP38.1 U1.8(VIN1) U1.12(VIN2) U5.1 U5.3 U5.5 U5.7
GND: C1.1 C2.1 C3.1 C4.1 C6.2 C7.1 C8.1 C9.1 C11.1 C12.2 C13.2 C14.1 C15.1 C16.1 C17.2 C18.1 C19.1 C20.1 D1.2(A) D2.2(A) D3.2(A) D4.2(A) Q1.2(S) Q2.2(S) Q3.2(S) Q5.2(S) R4.1 R20.1 R22.2 R25.2 R27.2 R43.1 R45.1 R46.1 R49.1 R51.1 R52.1 R56.1 R58.1 TP8.1 U1.3(AGND) U1.9(PGND1) U1.11(PGND2) U2.11(GND) U3.2 U4.2 U4.8 U4.17 U5.2 U5.4 U5.6 U5.8 U6.4 U6.6 U6.8 U7.2 U8.5 U8.13 U8.20
BTN_FUN_0: U3.1 U4.10
BTN_FUN_1: U4.11 U7.1
GPIO_PA0_T21: R57.1 U4.7
GPIO_PA4_D_CS: R34.2 U8.2
GPIO_PA5_D_SCK: R39.2 U8.4
GPIO_PA6_D_DC: R42.2 U8.3
GPIO_PA7_D_MOSI: R50.1 U8.6
GPIO_PA8_T11: R21.2 U4.4
GPIO_PA9_T12: R24.1 U4.5
GPIO_PA10_T13: R26.1 U4.6
GPIO_PB5_FP: D11.2(A) U8.19
GPIO_PB10_F4: R55.2 U8.17
GPIO_PB11_F5: D4.1(C) R20.2 U6.2 U8.18
GPIO_PB12_D_BUSY: D1.1(C) R13.1 U6.1 U8.7
GPIO_PB13_D_PWR: D3.1(C) R15.1 U5.9 U8.8
GPIO_PB14_D_RST: D2.1(C) R14.1 U5.10 U8.9
$1N1788: R4.2 U1.6(RT)
$1N1790: C11.2 U1.2(VCC)
$1N1799: C5.1 R2.1 U1.14(CBOOT)
$1N1800: C5.2 L1.1 U1.10(SW)
$1N1801: R2.2 U1.13(RBOOT)
$1N1803: C10.1 R5.1
$1N1828: C16.2 U2.1(dV/dT)
$1N1840: R49.2 U2.10(ILIM)
$1N2839: H1.1 R1.1
$1N10605: LED3.3(-) R31.2
$1N10606: LED3.4(-) R29.2
$1N10607: LED3.1(-) R30.2
$1N10610: Q1.1(G) R21.1 R22.1
$1N10615: Q2.1(G) R24.2 R25.1
$1N10618: Q3.1(G) R26.2 R27.1
$1N10624: Q1.3(D) R30.1
$1N10625: Q2.3(D) R29.1
$1N10626: Q3.3(D) R31.1
$1N11416: BUZ1.2 D14.2(A) Q5.3(D)
$1N11420: Q5.1(G) R57.2 R58.2
$1N12137: C18.2 R34.1 R37.2 R45.2
$1N12370: C19.2 R39.1 R46.2 R47.2
$1N12940: C20.2 R42.1 R43.2 R48.2
$1N13806: LED2.1(C) R50.2
$1N13885: LED1.1(K) R51.2
$1N14651: D11.1(K) D12.1(K) R52.2 U1.7(EN/SYNC)
$1N14703: D12.2(A) R1.2
$1N15114: D13.2(A) R54.1 R55.1
$1N15275: C10.2 R7.1 R56.2 U1.4(FB)

Not connected (* = marked no-connect by the designer): U2 9(EFET)*; U3 3* 4*; U4 1* 3* 9* 12* 13* 14* 15* 16* 18* 19* 20*; U7 3* 4*; U8 10* 11* 12* 14* 15* 16*

## Notes on the sheet
- DC-DC Converter
- eFuse Enable and MCU monitoring
- eFuse
- MCU enable or manual enable
- ~3.7A -> ~3.2A guaranteed @ -15% tollerance
- pulled-up input on MCU,
  high means GOOD
- 5.17V nominal, 5.35V abs max
- Stack Bus
- Status LED
- Base Board Connector
- MCU Connector
- 12V Status
- 5V Status
- Busmaster Status
- SMB_CLK
- SMB_DATA
- SMB_CLK
- SMB_DATA
- SMB_ALERT
- Yellow
- Green
- SMB_ALERT
- BUS_ENABLE
- INVERTED CONNECTOR !
- BUS_ENABLE
- CAN-MCU connectors on bottom side of mcu board
- Available GPIOs:
  GPIO_PA1_T22
  GPIO_PA2_T23
  GPIO_PA3_T24
  GPIO_PB2_F2
  GPIO_PB4_F3
- Function Buttons
- Buzzer
- Analog Inputs
- No need for clamping diodes, protection by divider and input TVS (Max 32.4V)
- No need for clamping diodes, protection by divider and output TVSs (Max 9.2V)
